# Altium schematic sheet ppc_ddr2.SchDoc: <SPECIFIC SHEET FUNCTION>
size A3; Date: DO NOT USE, RATHER USE PROJ OPTIONS; DrawnBy: DO NOT USE, RATHER USE PROJ OPTIONS; Engineer: DO NOT USE, RATHER USE PROJ OPTIONS; Organization: DO NOT USE, RATHER USE PROJ OPTIONS; DocumentNumber: DO NOT USE, RATHER USE PROJ OPTIONS; Revision: DO NOT USE, RATHER USE PROJ OPTIONS; SheetNumber: 8; SheetTotal: 25; SCH_Sheet_Filename: <Filename.SchDoc>; CurrentTime: DO NOT USE, RATHER USE PROJ OPTIONS; Time: DO NOT USE, RATHER USE PROJ OPTIONS; DocumentFullPathAndName: DO NOT USE, RATHER USE PROJ OPTIONS; DocumentName: DO NOT USE, RATHER USE PROJ OPTIONS; ModifiedDate: DO NOT USE, RATHER USE PROJ OPTIONS; ImagePath: DO NOT USE, RATHER USE PROJ OPTIONS
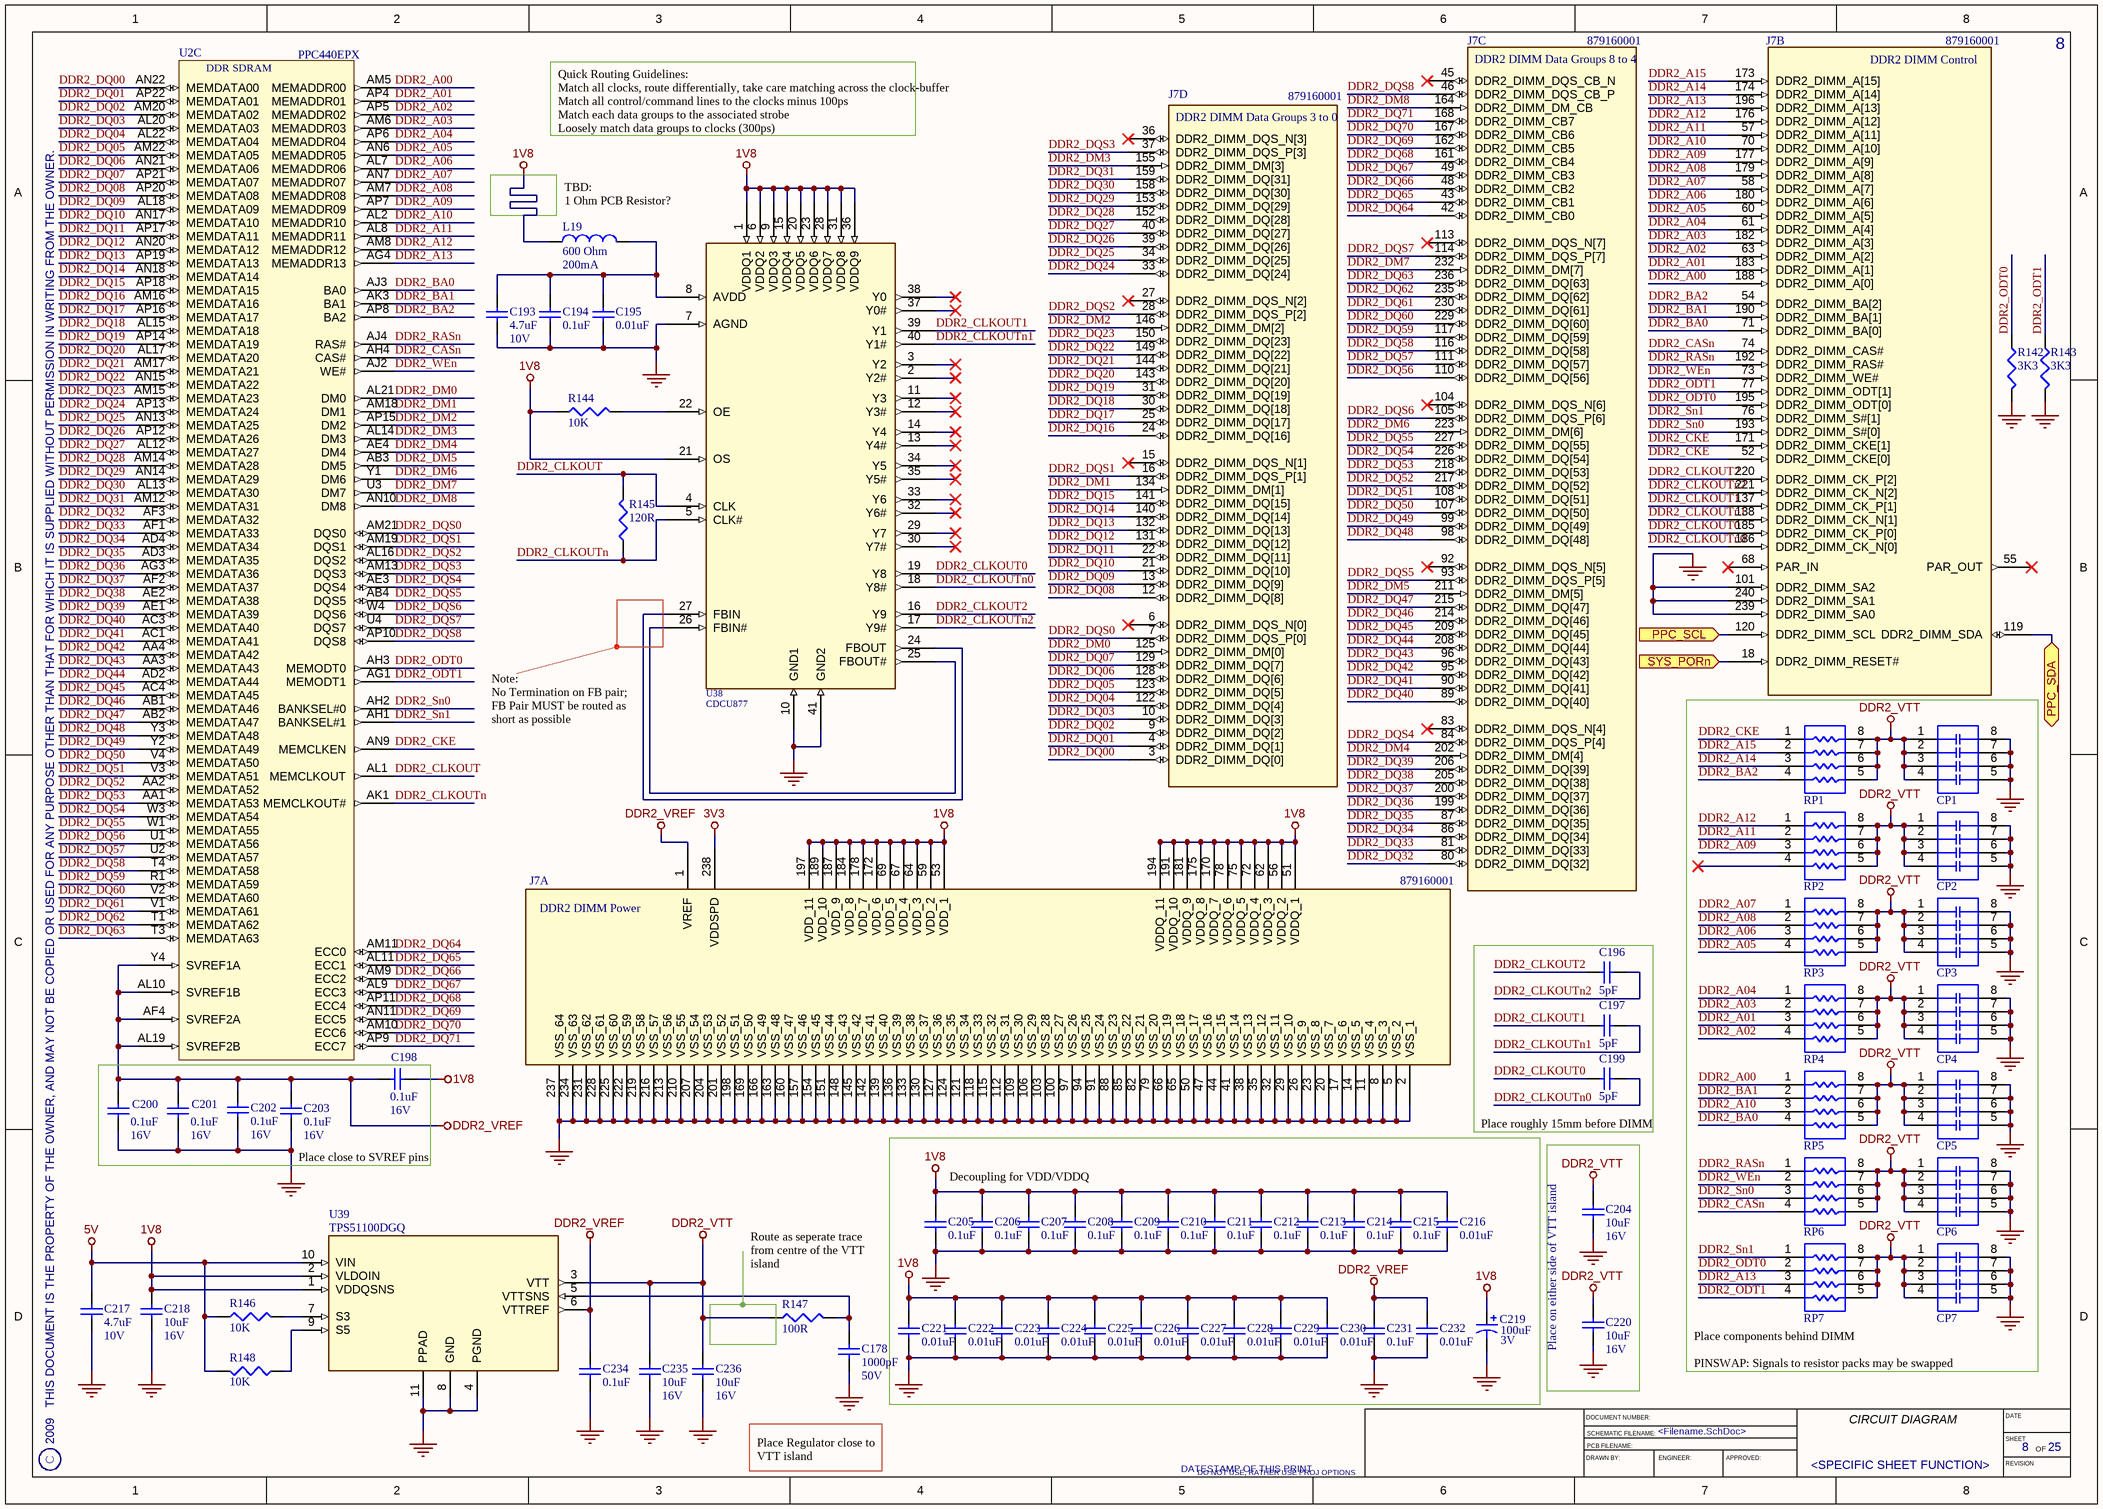
[diagram p0: ppc_ddr2.SchDoc]

## Parts
C178  value 1000pF  Rating: 50V  [CAPC1005L]  (hidden comment: CapStd)
C193  value 4.7uF  Rating: 10V  [2012-0805_CAPC2012X11N]  (hidden comment: CapStd)
C194  value 0.1uF  [CAPC1005L]  (hidden comment: CapStd)
C195  value 0.01uF  [CAPC1005L]  (hidden comment: CapStd)
C196  value 5pF  [CAPC1005L]  (hidden comment: CapStd)
C197  value 5pF  [CAPC1005L]  (hidden comment: CapStd)
C198  value 0.1uF  Rating: 16V  [CAPC1005L]  (hidden comment: CapStd)
C199  value 5pF  [CAPC1005L]  (hidden comment: CapStd)
C200  value 0.1uF  Rating: 16V  [CAPC1005L]  (hidden comment: CapStd)
C201  value 0.1uF  Rating: 16V  [CAPC1005L]  (hidden comment: CapStd)
C202  value 0.1uF  Rating: 16V  [CAPC1005L]  (hidden comment: CapStd)
C203  value 0.1uF  Rating: 16V  [CAPC1005L]  (hidden comment: CapStd)
C204  value 10uF  Rating: 16V  [CAPC3225L]  (hidden comment: CapStd)
C205  value 0.1uF  [CAPC1005L]  (hidden comment: CapStd)
C206  value 0.1uF  [CAPC1005L]  (hidden comment: CapStd)
C207  value 0.1uF  [CAPC1005L]  (hidden comment: CapStd)
C208  value 0.1uF  [CAPC1005L]  (hidden comment: CapStd)
C209  value 0.1uF  [CAPC1005L]  (hidden comment: CapStd)
C210  value 0.1uF  [CAPC1005L]  (hidden comment: CapStd)
C211  value 0.1uF  [CAPC1005L]  (hidden comment: CapStd)
C212  value 0.1uF  [CAPC1005L]  (hidden comment: CapStd)
C213  value 0.1uF  [CAPC1005L]  (hidden comment: CapStd)
C214  value 0.1uF  [CAPC1005L]  (hidden comment: CapStd)
C215  value 0.1uF  [CAPC1005L]  (hidden comment: CapStd)
C216  value 0.01uF  [CAPC1005L]  (hidden comment: CapStd)
C217  value 4.7uF  Rating: 10V  [2012-0805_CAPC2012X11N]  (hidden comment: CapStd)
C218  value 10uF  Rating: 16V  [CAPC3225L]  (hidden comment: CapStd)
C219  value 100uF  Rating: 3V  [Tantalum-7343-CASE-D_CAPM7343X31N]  (hidden comment: CapPol)
C220  value 10uF  Rating: 16V  [CAPC3225L]  (hidden comment: CapStd)
C221  value 0.01uF  [CAPC1005L]  (hidden comment: CapStd)
C222  value 0.01uF  [CAPC1005L]  (hidden comment: CapStd)
C223  value 0.01uF  [CAPC1005L]  (hidden comment: CapStd)
C224  value 0.01uF  [CAPC1005L]  (hidden comment: CapStd)
C225  value 0.01uF  [CAPC1005L]  (hidden comment: CapStd)
C226  value 0.01uF  [CAPC1005L]  (hidden comment: CapStd)
C227  value 0.01uF  [CAPC1005L]  (hidden comment: CapStd)
C228  value 0.01uF  [CAPC1005L]  (hidden comment: CapStd)
C229  value 0.01uF  [CAPC1005L]  (hidden comment: CapStd)
C230  value 0.01uF  [CAPC1005L]  (hidden comment: CapStd)
C231  value 0.1uF  [CAPC1005L]  (hidden comment: CapStd)
C232  value 0.01uF  [CAPC1005L]  (hidden comment: CapStd)
C234  value 0.1uF  [CAPC1005L]  (hidden comment: CapStd)
C235  value 10uF  Rating: 16V  [CAPC3225L]  (hidden comment: CapStd)
C236  value 10uF  Rating: 16V  [CAPC3225L]  (hidden comment: CapStd)
CP1  CapPack4  [CAPCAF50P125X200X100-8N]  (value not drawn)
CP2  CapPack4  [CAPCAF50P125X200X100-8N]  (value not drawn)
CP3  CapPack4  [CAPCAF50P125X200X100-8N]  (value not drawn)
CP4  CapPack4  [CAPCAF50P125X200X100-8N]  (value not drawn)
CP5  CapPack4  [CAPCAF50P125X200X100-8N]  (value not drawn)
CP6  CapPack4  [CAPCAF50P125X200X100-8N]  (value not drawn)
CP7  CapPack4  [CAPCAF50P125X200X100-8N]  (value not drawn)
J7  879160001  [MOLEX87916001]  (parts A,B,C,D of 5)
L19  value 600 Ohm  Rating: 200mA  [INDC2012L]  (hidden comment: Inductor)
R142  value 3K3  [RESC1608L]  (hidden comment: ResStd)
R143  value 3K3  [RESC1608L]  (hidden comment: ResStd)
R144  value 10K  [RESC1608L]  (hidden comment: ResStd)
R145  value 120R  [RESC1005L]  (hidden comment: ResStd)
R146  value 10K  [RESC1005L]  (hidden comment: ResStd)
R147  value 100R  [RESC1005L]  (hidden comment: ResStd)
R148  value 10K  [RESC1005L]  (hidden comment: ResStd)
RP1  ResPack4  [RESCAV50P100X200X55-8N]  (value not drawn)
RP2  ResPack4  [RESCAV50P100X200X55-8N]  (value not drawn)
RP3  ResPack4  [RESCAV50P100X200X55-8N]  (value not drawn)
RP4  ResPack4  [RESCAV50P100X200X55-8N]  (value not drawn)
RP5  ResPack4  [RESCAV50P100X200X55-8N]  (value not drawn)
RP6  ResPack4  [RESCAV50P100X200X55-8N]  (value not drawn)
RP7  ResPack4  [RESCAV50P100X200X55-8N]  (value not drawn)
U2  PPC440EPX  [BGA680C100P34X34_3500X3500X265]  (part C of 11)
U38  CDCU877  [PQFN50P602X602X100-41N]
U39  TPS51100DGQ  [SOP50P490X110-11N]

## Blocks framed on the sheet
Place on either side of VTT island: C204 C220

## Ports
PPC_SCL (in), PPC_SDA (bidir), SYS_PORn (in)

## Nets
1V8: C198.2 C205.2 C206.2 C207.2 C208.2 C209.2 C210.2 C211.2 C212.2 C213.2 C214.2 C215.2 C216.2 C218.1 C219.1 C221.2 C222.2 C223.2 C224.2 C225.2 C226.2 C227.2 C228.2 C229.2 C230.2 J7.51(VDDQ_1) J7.53(VDD_1) J7.56(VDDQ_2) J7.59(VDD_2) J7.62(VDDQ_3) J7.64(VDD_3) J7.67(VDD_4) J7.69(VDD_5) J7.72(VDDQ_4) J7.75(VDDQ_5) J7.78(VDDQ_6) J7.170(VDDQ_7) J7.172(VDD_6) J7.175(VDDQ_8) J7.178(VDD_7) J7.181(VDDQ_9) J7.184(VDD_8) J7.187(VDD_9) J7.189(VDD_10) J7.191(VDDQ_10) J7.194(VDDQ_11) J7.197(VDD_11) L19.1 R144.1 U38.1(VDDQ1) U38.6(VDDQ2) U38.9(VDDQ3) U38.15(VDDQ4) U38.20(VDDQ5) U38.21(OS) U38.23(VDDQ6) U38.28(VDDQ7) U38.31(VDDQ8) U38.36(VDDQ9) U39.1(VDDQSNS) U39.2(VLDOIN)
3V3: J7.238(VDDSPD)
5V: C217.1 R146.1 R148.2 U39.10(VIN)
DDR2_VREF: C198.1 C200.1 C201.1 C202.1 C203.1 C231.2 C232.2 C234.2 J7.1(VREF) U2.AF4(SVREF2A) U2.AL10(SVREF1B) U2.AL19(SVREF2B) U2.Y4(SVREF1A) U39.6(VTTREF)
DDR2_VTT: C204.1 C220.1 C235.1 C236.1 CP1.1 CP1.2 CP1.3 CP1.4 CP2.1 CP2.2 CP2.3 CP2.4 CP3.1 CP3.2 CP3.3 CP3.4 CP4.1 CP4.2 CP4.3 CP4.4 CP5.1 CP5.2 CP5.3 CP5.4 CP6.1 CP6.2 CP6.3 CP6.4 CP7.1 CP7.2 CP7.3 CP7.4 R147.1 RP1.5 RP1.6 RP1.7 RP1.8 RP2.5 RP2.6 RP2.7 RP2.8 RP3.5 RP3.6 RP3.7 RP3.8 RP4.5 RP4.6 RP4.7 RP4.8 RP5.5 RP5.6 RP5.7 RP5.8 RP6.5 RP6.6 RP6.7 RP6.8 RP7.5 RP7.6 RP7.7 RP7.8 U39.3(VTT)
GND: C178.1 C193.2 C194.1 C195.1 C200.2 C201.2 C202.2 C203.2 C204.2 C205.1 C206.1 C207.1 C208.1 C209.1 C210.1 C211.1 C212.1 C213.1 C214.1 C215.1 C216.1 C217.2 C218.2 C219.2 C220.2 C221.1 C222.1 C223.1 C224.1 C225.1 C226.1 C227.1 C228.1 C229.1 C230.1 C231.1 C232.1 C234.1 C235.2 C236.2 CP1.5 CP1.6 CP1.7 CP1.8 CP2.5 CP2.6 CP2.7 CP2.8 CP3.5 CP3.6 CP3.7 CP3.8 CP4.5 CP4.6 CP4.7 CP4.8 CP5.5 CP5.6 CP5.7 CP5.8 CP6.5 CP6.6 CP6.7 CP6.8 CP7.5 CP7.6 CP7.7 CP7.8 J7.2(VSS_1) J7.5(VSS_2) J7.8(VSS_3) J7.11(VSS_4) J7.14(VSS_5) J7.17(VSS_6) J7.20(VSS_7) J7.23(VSS_8) J7.26(VSS_9) J7.29(VSS_10) J7.32(VSS_11) J7.35(VSS_12) J7.38(VSS_13) J7.41(VSS_14) J7.44(VSS_15) J7.47(VSS_16) J7.50(VSS_17) J7.65(VSS_18) J7.66(VSS_19) J7.79(VSS_20) J7.82(VSS_21) J7.85(VSS_22) J7.88(VSS_23) J7.91(VSS_24) J7.94(VSS_25) J7.97(VSS_26) J7.100(VSS_27) J7.101(DDR2_DIMM_SA2) J7.103(VSS_28) J7.106(VSS_29) J7.109(VSS_30) J7.112(VSS_31) J7.115(VSS_32) J7.118(VSS_33) J7.121(VSS_34) J7.124(VSS_35) J7.127(VSS_36) J7.130(VSS_37) J7.133(VSS_38) J7.136(VSS_39) J7.139(VSS_40) J7.142(VSS_41) J7.145(VSS_42) J7.148(VSS_43) J7.151(VSS_44) J7.154(VSS_45) J7.157(VSS_46) J7.160(VSS_47) J7.163(VSS_48) J7.166(VSS_49) J7.169(VSS_50) J7.198(VSS_51) J7.201(VSS_52) J7.204(VSS_53) J7.207(VSS_54) J7.210(VSS_55) J7.213(VSS_56) J7.216(VSS_57) J7.219(VSS_58) J7.222(VSS_59) J7.225(VSS_60) J7.228(VSS_61) J7.231(VSS_62) J7.234(VSS_63) J7.237(VSS_64) J7.239(DDR2_DIMM_SA0) J7.240(DDR2_DIMM_SA1) R142.2 R143.2 U38.7(AGND) U38.10(GND1) U38.41(GND2) U39.4(PGND) U39.8(GND) U39.11(PPAD)
DDR2_A00: J7.188(DDR2_DIMM_A[0]) RP5.1 U2.AM5(MEMADDR00)
DDR2_A01: J7.183(DDR2_DIMM_A[1]) RP4.3 U2.AP4(MEMADDR01)
DDR2_A02: J7.63(DDR2_DIMM_A[2]) RP4.4 U2.AP5(MEMADDR02)
DDR2_A03: J7.182(DDR2_DIMM_A[3]) RP4.2 U2.AM6(MEMADDR03)
DDR2_A04: J7.61(DDR2_DIMM_A[4]) RP4.1 U2.AP6(MEMADDR04)
DDR2_A05: J7.60(DDR2_DIMM_A[5]) RP3.4 U2.AN6(MEMADDR05)
DDR2_A06: J7.180(DDR2_DIMM_A[6]) RP3.3 U2.AL7(MEMADDR06)
DDR2_A07: J7.58(DDR2_DIMM_A[7]) RP3.1 U2.AN7(MEMADDR07)
DDR2_A08: J7.179(DDR2_DIMM_A[8]) RP3.2 U2.AM7(MEMADDR08)
DDR2_A09: J7.177(DDR2_DIMM_A[9]) RP2.3 U2.AP7(MEMADDR09)
DDR2_A10: J7.70(DDR2_DIMM_A[10]) RP5.3 U2.AL2(MEMADDR10)
DDR2_A11: J7.57(DDR2_DIMM_A[11]) RP2.2 U2.AL8(MEMADDR11)
DDR2_A12: J7.176(DDR2_DIMM_A[12]) RP2.1 U2.AM8(MEMADDR12)
DDR2_A13: J7.196(DDR2_DIMM_A[13]) RP7.3 U2.AG4(MEMADDR13)
DDR2_A14: J7.174(DDR2_DIMM_A[14]) RP1.3
DDR2_A15: J7.173(DDR2_DIMM_A[15]) RP1.2
DDR2_BA0: J7.71(DDR2_DIMM_BA[0]) RP5.4 U2.AJ3(BA0)
DDR2_BA1: J7.190(DDR2_DIMM_BA[1]) RP5.2 U2.AK3(BA1)
DDR2_BA2: J7.54(DDR2_DIMM_BA[2]) RP1.4 U2.AP8(BA2)
DDR2_CASn: J7.74(DDR2_DIMM_CAS#) RP6.4 U2.AH4(CAS#)
DDR2_CKE: J7.52(DDR2_DIMM_CKE[0]) J7.171(DDR2_DIMM_CKE[1]) RP1.1 U2.AN9(MEMCLKEN)
DDR2_CLKOUT: R145.2 U2.AL1(MEMCLKOUT) U38.4(CLK)
DDR2_CLKOUT0: C199.1 J7.185(DDR2_DIMM_CK_P[0]) U38.19(Y8)
DDR2_CLKOUT1: C197.1 J7.137(DDR2_DIMM_CK_P[1]) U38.39(Y1)
DDR2_CLKOUT2: C196.1 J7.220(DDR2_DIMM_CK_P[2]) U38.16(Y9)
DDR2_CLKOUTn: R145.1 U2.AK1(MEMCLKOUT#) U38.5(CLK#)
DDR2_CLKOUTn0: C199.2 J7.186(DDR2_DIMM_CK_N[0]) U38.18(Y8#)
DDR2_CLKOUTn1: C197.2 J7.138(DDR2_DIMM_CK_N[1]) U38.40(Y1#)
DDR2_CLKOUTn2: C196.2 J7.221(DDR2_DIMM_CK_N[2]) U38.17(Y9#)
DDR2_DM0: J7.125(DDR2_DIMM_DM[0]) U2.AL21(DM0)
DDR2_DM1: J7.134(DDR2_DIMM_DM[1]) U2.AM18(DM1)
DDR2_DM2: J7.146(DDR2_DIMM_DM[2]) U2.AP15(DM2)
DDR2_DM3: J7.155(DDR2_DIMM_DM[3]) U2.AL14(DM3)
DDR2_DM4: J7.202(DDR2_DIMM_DM[4]) U2.AE4(DM4)
DDR2_DM5: J7.211(DDR2_DIMM_DM[5]) U2.AB3(DM5)
DDR2_DM6: J7.223(DDR2_DIMM_DM[6]) U2.Y1(DM6)
DDR2_DM7: J7.232(DDR2_DIMM_DM[7]) U2.U3(DM7)
DDR2_DM8: J7.164(DDR2_DIMM_DM_CB) U2.AN10(DM8)
DDR2_DQ00: J7.3(DDR2_DIMM_DQ[0]) U2.AN22(MEMDATA00)
DDR2_DQ01: J7.4(DDR2_DIMM_DQ[1]) U2.AP22(MEMDATA01)
DDR2_DQ02: J7.9(DDR2_DIMM_DQ[2]) U2.AM20(MEMDATA02)
DDR2_DQ03: J7.10(DDR2_DIMM_DQ[3]) U2.AL20(MEMDATA03)
DDR2_DQ04: J7.122(DDR2_DIMM_DQ[4]) U2.AL22(MEMDATA04)
DDR2_DQ05: J7.123(DDR2_DIMM_DQ[5]) U2.AM22(MEMDATA05)
DDR2_DQ06: J7.128(DDR2_DIMM_DQ[6]) U2.AN21(MEMDATA06)
DDR2_DQ07: J7.129(DDR2_DIMM_DQ[7]) U2.AP21(MEMDATA07)
DDR2_DQ08: J7.12(DDR2_DIMM_DQ[8]) U2.AP20(MEMDATA08)
DDR2_DQ09: J7.13(DDR2_DIMM_DQ[9]) U2.AL18(MEMDATA09)
DDR2_DQ10: J7.21(DDR2_DIMM_DQ[10]) U2.AN17(MEMDATA10)
DDR2_DQ11: J7.22(DDR2_DIMM_DQ[11]) U2.AP17(MEMDATA11)
DDR2_DQ12: J7.131(DDR2_DIMM_DQ[12]) U2.AN20(MEMDATA12)
DDR2_DQ13: J7.132(DDR2_DIMM_DQ[13]) U2.AP19(MEMDATA13)
DDR2_DQ14: J7.140(DDR2_DIMM_DQ[14]) U2.AN18(MEMDATA14)
DDR2_DQ15: J7.141(DDR2_DIMM_DQ[15]) U2.AP18(MEMDATA15)
DDR2_DQ16: J7.24(DDR2_DIMM_DQ[16]) U2.AM16(MEMDATA16)
DDR2_DQ17: J7.25(DDR2_DIMM_DQ[17]) U2.AP16(MEMDATA17)
DDR2_DQ18: J7.30(DDR2_DIMM_DQ[18]) U2.AL15(MEMDATA18)
DDR2_DQ19: J7.31(DDR2_DIMM_DQ[19]) U2.AP14(MEMDATA19)
DDR2_DQ20: J7.143(DDR2_DIMM_DQ[20]) U2.AL17(MEMDATA20)
DDR2_DQ21: J7.144(DDR2_DIMM_DQ[21]) U2.AM17(MEMDATA21)
DDR2_DQ22: J7.149(DDR2_DIMM_DQ[22]) U2.AN15(MEMDATA22)
DDR2_DQ23: J7.150(DDR2_DIMM_DQ[23]) U2.AM15(MEMDATA23)
DDR2_DQ24: J7.33(DDR2_DIMM_DQ[24]) U2.AP13(MEMDATA24)
DDR2_DQ25: J7.34(DDR2_DIMM_DQ[25]) U2.AN13(MEMDATA25)
DDR2_DQ26: J7.39(DDR2_DIMM_DQ[26]) U2.AP12(MEMDATA26)
DDR2_DQ27: J7.40(DDR2_DIMM_DQ[27]) U2.AL12(MEMDATA27)
DDR2_DQ28: J7.152(DDR2_DIMM_DQ[28]) U2.AM14(MEMDATA28)
DDR2_DQ29: J7.153(DDR2_DIMM_DQ[29]) U2.AN14(MEMDATA29)
DDR2_DQ30: J7.158(DDR2_DIMM_DQ[30]) U2.AL13(MEMDATA30)
DDR2_DQ31: J7.159(DDR2_DIMM_DQ[31]) U2.AM12(MEMDATA31)
DDR2_DQ32: J7.80(DDR2_DIMM_DQ[32]) U2.AF3(MEMDATA32)
DDR2_DQ33: J7.81(DDR2_DIMM_DQ[33]) U2.AF1(MEMDATA33)
DDR2_DQ34: J7.86(DDR2_DIMM_DQ[34]) U2.AD4(MEMDATA34)
DDR2_DQ35: J7.87(DDR2_DIMM_DQ[35]) U2.AD3(MEMDATA35)
DDR2_DQ36: J7.199(DDR2_DIMM_DQ[36]) U2.AG3(MEMDATA36)
DDR2_DQ37: J7.200(DDR2_DIMM_DQ[37]) U2.AF2(MEMDATA37)
DDR2_DQ38: J7.205(DDR2_DIMM_DQ[38]) U2.AE2(MEMDATA38)
DDR2_DQ39: J7.206(DDR2_DIMM_DQ[39]) U2.AE1(MEMDATA39)
DDR2_DQ40: J7.89(DDR2_DIMM_DQ[40]) U2.AC3(MEMDATA40)
DDR2_DQ41: J7.90(DDR2_DIMM_DQ[41]) U2.AC1(MEMDATA41)
DDR2_DQ42: J7.95(DDR2_DIMM_DQ[42]) U2.AA4(MEMDATA42)
DDR2_DQ43: J7.96(DDR2_DIMM_DQ[43]) U2.AA3(MEMDATA43)
DDR2_DQ44: J7.208(DDR2_DIMM_DQ[44]) U2.AD2(MEMDATA44)
DDR2_DQ45: J7.209(DDR2_DIMM_DQ[45]) U2.AC4(MEMDATA45)
DDR2_DQ46: J7.214(DDR2_DIMM_DQ[46]) U2.AB1(MEMDATA46)
DDR2_DQ47: J7.215(DDR2_DIMM_DQ[47]) U2.AB2(MEMDATA47)
DDR2_DQ48: J7.98(DDR2_DIMM_DQ[48]) U2.Y3(MEMDATA48)
DDR2_DQ49: J7.99(DDR2_DIMM_DQ[49]) U2.Y2(MEMDATA49)
DDR2_DQ50: J7.107(DDR2_DIMM_DQ[50]) U2.V4(MEMDATA50)
DDR2_DQ51: J7.108(DDR2_DIMM_DQ[51]) U2.V3(MEMDATA51)
DDR2_DQ52: J7.217(DDR2_DIMM_DQ[52]) U2.AA2(MEMDATA52)
DDR2_DQ53: J7.218(DDR2_DIMM_DQ[53]) U2.AA1(MEMDATA53)
DDR2_DQ54: J7.226(DDR2_DIMM_DQ[54]) U2.W3(MEMDATA54)
DDR2_DQ55: J7.227(DDR2_DIMM_DQ[55]) U2.W1(MEMDATA55)
DDR2_DQ56: J7.110(DDR2_DIMM_DQ[56]) U2.U1(MEMDATA56)
DDR2_DQ57: J7.111(DDR2_DIMM_DQ[57]) U2.U2(MEMDATA57)
DDR2_DQ58: J7.116(DDR2_DIMM_DQ[58]) U2.T4(MEMDATA58)
DDR2_DQ59: J7.117(DDR2_DIMM_DQ[59]) U2.R1(MEMDATA59)
DDR2_DQ60: J7.229(DDR2_DIMM_DQ[60]) U2.V2(MEMDATA60)
DDR2_DQ61: J7.230(DDR2_DIMM_DQ[61]) U2.V1(MEMDATA61)
DDR2_DQ62: J7.235(DDR2_DIMM_DQ[62]) U2.T1(MEMDATA62)
DDR2_DQ63: J7.236(DDR2_DIMM_DQ[63]) U2.T3(MEMDATA63)
DDR2_DQ64: J7.42(DDR2_DIMM_CB0) U2.AM11(ECC0)
DDR2_DQ65: J7.43(DDR2_DIMM_CB1) U2.AL11(ECC1)
DDR2_DQ66: J7.48(DDR2_DIMM_CB2) U2.AM9(ECC2)
DDR2_DQ67: J7.49(DDR2_DIMM_CB3) U2.AL9(ECC3)
DDR2_DQ68: J7.161(DDR2_DIMM_CB4) U2.AP11(ECC4)
DDR2_DQ69: J7.162(DDR2_DIMM_CB5) U2.AN11(ECC5)
DDR2_DQ70: J7.167(DDR2_DIMM_CB6) U2.AM10(ECC6)
DDR2_DQ71: J7.168(DDR2_DIMM_CB7) U2.AP9(ECC7)
DDR2_DQS0: J7.7(DDR2_DIMM_DQS_P[0]) U2.AM21(DQS0)
DDR2_DQS1: J7.16(DDR2_DIMM_DQS_P[1]) U2.AM19(DQS1)
DDR2_DQS2: J7.28(DDR2_DIMM_DQS_P[2]) U2.AL16(DQS2)
DDR2_DQS3: J7.37(DDR2_DIMM_DQS_P[3]) U2.AM13(DQS3)
DDR2_DQS4: J7.84(DDR2_DIMM_DQS_P[4]) U2.AE3(DQS4)
DDR2_DQS5: J7.93(DDR2_DIMM_DQS_P[5]) U2.AB4(DQS5)
DDR2_DQS6: J7.105(DDR2_DIMM_DQS_P[6]) U2.W4(DQS6)
DDR2_DQS7: J7.114(DDR2_DIMM_DQS_P[7]) U2.U4(DQS7)
DDR2_DQS8: J7.46(DDR2_DIMM_DQS_CB_P) U2.AP10(DQS8)
DDR2_ODT0: J7.195(DDR2_DIMM_ODT[0]) R142.1 RP7.2 U2.AH3(MEMODT0)
DDR2_ODT1: J7.77(DDR2_DIMM_ODT[1]) R143.1 RP7.4 U2.AG1(MEMODT1)
DDR2_RASn: J7.192(DDR2_DIMM_RAS#) RP6.1 U2.AJ4(RAS#)
DDR2_Sn0: J7.193(DDR2_DIMM_S#[0]) RP6.3 U2.AH2(BANKSEL#0)
DDR2_Sn1: J7.76(DDR2_DIMM_S#[1]) RP7.1 U2.AH1(BANKSEL#1)
DDR2_WEn: J7.73(DDR2_DIMM_WE#) RP6.2 U2.AJ2(WE#)
PPC_SCL: J7.120(DDR2_DIMM_SCL) ; port PPC_SCL
PPC_SDA: J7.119(DDR2_DIMM_SDA) ; port PPC_SDA
SYS_PORn: J7.18(DDR2_DIMM_RESET#) ; port SYS_PORn
NetC178_2: C178.2 R147.2 U39.5(VTTSNS)
NetC193_1: C193.1 C194.2 C195.2 L19.2 U38.8(AVDD)
NetR144_2: R144.2 U38.22(OE)
NetR146_2: R146.2 U39.7(S3)
NetR148_1: R148.1 U39.9(S5)
NetU38_24: U38.24(FBOUT) U38.27(FBIN)
NetU38_25: U38.25(FBOUT#) U38.26(FBIN#)

Not connected (* = marked no-connect by the designer): J7 6(DDR2_DIMM_DQS_N[0])* 15(DDR2_DIMM_DQS_N[1])* 27(DDR2_DIMM_DQS_N[2])* 36(DDR2_DIMM_DQS_N[3])* 45(DDR2_DIMM_DQS_CB_N)* 55(PAR_OUT)* 68(PAR_IN)* 83(DDR2_DIMM_DQS_N[4])* 92(DDR2_DIMM_DQS_N[5])* 104(DDR2_DIMM_DQS_N[6])* 113(DDR2_DIMM_DQS_N[7])*; RP2 4*; U38 2(Y2#)* 3(Y2)* 11(Y3)* 12(Y3#)* 13(Y4#)* 14(Y4)* 29(Y7)* 30(Y7#)* 32(Y6#)* 33(Y6)* 34(Y5)* 35(Y5#)* 37(Y0#)* 38(Y0)*

## Notes on the sheet
- Quick Routing Guidelines:
  Match all clocks, route differentially, take care matching across the clock-buffer
  Match all control/command lines to the clocks minus 100ps
  Match each data groups to the associated strobe
  Loosely match data groups to clocks (300ps)
- TBD:
  1 Ohm PCB Resistor?
- Note:
  No Termination on FB pair;
  FB Pair MUST be routed as short as possible
- (near C203) Place close to SVREF pins
- Decoupling for VDD/VDDQ
- (near C199) Place roughly 15mm before DIMM
- Route as seperate trace from centre of the VTT island
- Place components behind DIMM
  PINSWAP: Signals to resistor packs may be swapped
- Place Regulator close to VTT island
- 2009   THIS DOCUMENT IS THE PROPERTY OF THE OWNER, AND MAY NOT BE COPIED OR USED FOR ANY PURPOSE OTHER THAN THAT FOR WHICH IT IS SUPPLIED WITHOUT PERMISSION IN WRITING FROM THE OWNER.
- C
- DATESTAMP OF THIS PRINT
- DRAWN BY:
- DOCUMENT NUMBER:
- SCHEMATIC FILENAME:
- PCB FILENAME:
- ENGINEER:
- APPROVED:
- CIRCUIT DIAGRAM
- DATE
- SHEET
- REVISION
- OF
- (in symbol ddr2_dimm_240, part A) DDR2 DIMM Power
- (in symbol ddr2_dimm_240, part B) DDR2 DIMM Control
- (in symbol ddr2_dimm_240, part C) DDR2 DIMM Data Groups 8 to 4
- (in symbol ddr2_dimm_240, part D) DDR2 DIMM Data Groups 3 to 0
- (in symbol PPC440EPX, part C) DDR SDRAM

## Library data of the parts
C178 = CapStd: Capacitor; Manufacturer: Murata; Part: GRM155R61A102KA01B; Tolerance: 15%
C193 C217 = CapStd: Capacitor; Manufacturer: MURATA; Part: GRM21BR61E475KA12K; Tolerance: 10%
C194 C205-C215 C231 C234 = CapStd: Capacitor; Manufacturer: MURATA; Part: GRM155R71A104KA01B; Rating: 10; Tolerance: 10%
C195 C216 C221-C230 C232 = CapStd: Capacitor; Manufacturer: MURATA; Part: GRM155R7EA103KA01B; Rating: 25V; Tolerance: 10%
C196 C197 C199 = CapStd: Capacitor; Manufacturer: MURATA; Part: GRM1555C1H5R0CZ01B; Rating: 50V; Tolerance: 10%
C198 C200-C203 = CapStd: Capacitor; Manufacturer: VENKEL; Part: C0402X7R160-104KN
C204 C218 C220 C235 C236 = CapStd: Capacitor; Manufacturer: MURATA; Part: GRM32DR61C106KA01K; Tolerance: 10%
C219 = CapPol: Polarized Capacitor; Manufacturer: AVX; Part: TPSB107K006R
CP1-CP7 = CapPack4: Isolated Capacitor Network; Part: GNM214B11C104MA01B; Manufacturer: MURATA; Value: 100nF; Rating: 16V; Tolerance: *
J7 = ddr2_dimm_240: 240-pin DDR2 DIMM Socket; Manufacturer: MOLEX; Part: 879160001
L19 = Inductor: Manufacturer: Murata; Part: BLM21B601SPT
R142 R143 = ResStd: Resistor; Part: 0402WGJ033T1E; Manufacturer: ROYALOHM; Tolerance: 5%; Rating: 0.0625W
R144 R146 R148 = ResStd: Resistor; Part: 0402WGJ103T1E; Manufacturer: ROYALOHM; Tolerance: 5%; Rating: 0.0625W
R145 = ResStd: Resistor; Part: 0402WGJ0120T1E; Manufacturer: ROYALOHM; Tolerance: 5%; Rating: 0.0625W
R147 = ResStd: Resistor; Part: 0402WGJ0101T1E; Manufacturer: ROYALOHM; Tolerance: 5%; Rating: 0.0625W
RP1-RP7 = ResPack4: Isolated Resistor Network; Part: 4D02WGJ0510B1E; Manufacturer: ROYAL OHM; Tolerance: 1%; Value: 49.9R; Rating: *
U2 = PPC440EPX: Applied Micro PPC440EPx; Part: PPC440EPX-NTA533T; Manufacturer: AMCC
U38 = CDCU877: SSTL Zero-Delay Clock Buffer; Manufacturer: Texas Instruments; Part: CDCU877
U39 = TPS51100DGQ: 3A Sink/Source Regulator; Manufacturer: Texas Instruments; Part: TPS51100DGQ